# EAGLE design Murata D1U54P Power Supply Adapter rev2 (EAGLE 8.3.1)
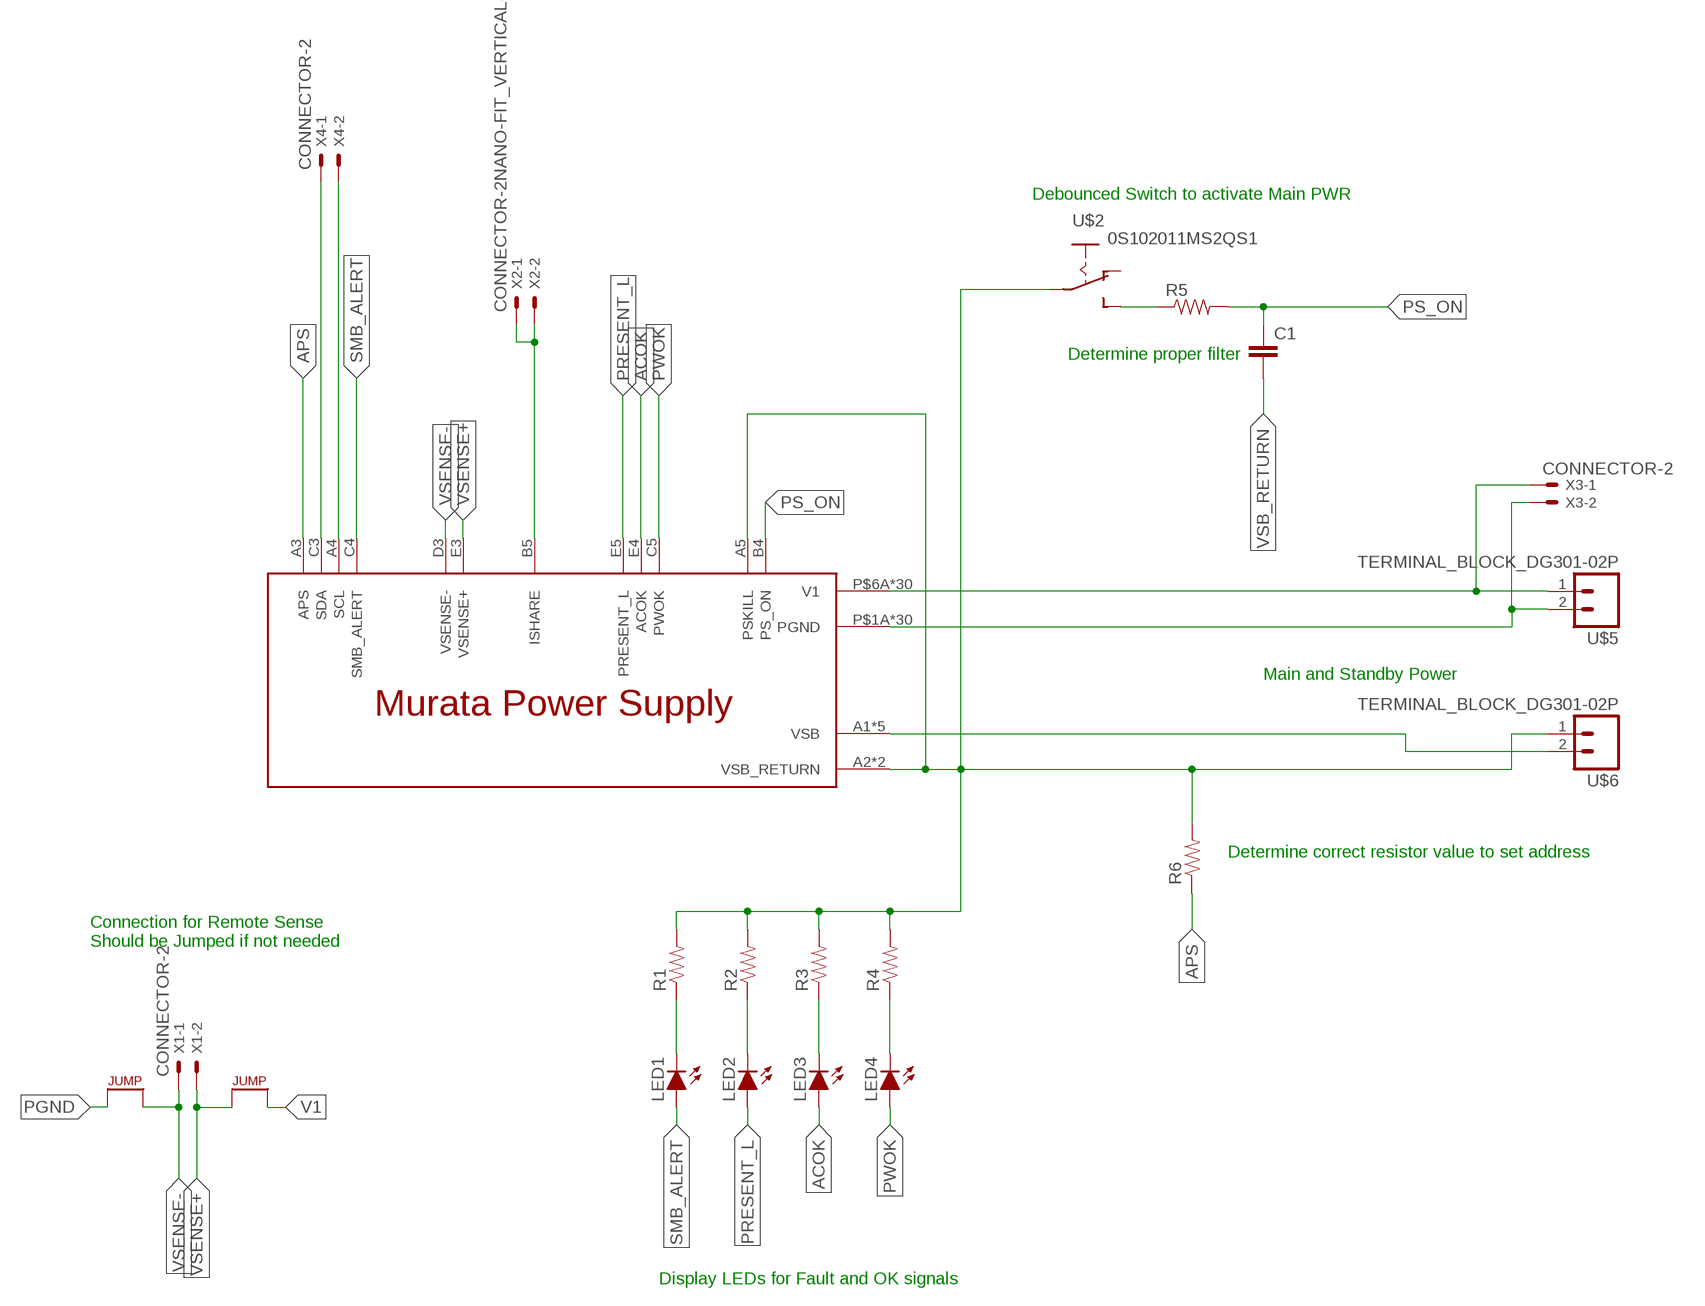
[diagram p0: schematic, sheet 1]

## Parts
C1  CAP0805  [0805]
LED1  LED-0805  [LED-805]
LED2  LED-0805  [LED-805]
LED3  LED-0805  [LED-805]
LED4  LED-0805  [LED-805]
R1  RESISTOR0805-RES  [0805]
R2  RESISTOR0805-RES  [0805]
R3  RESISTOR0805-RES  [0805]
R4  RESISTOR0805-RES  [0805]
R5  RESISTOR0805-RES  [0805]
R6  RESISTOR0805-RES  [0805]
U$1  MURATA_POWER_SUPPLY  [MURATA_POWER_SUPPLY_CONNECTOR]
U$2  0S102011MS2QS1  [0S102011MS2QS1]
U$3  JUMPER.1  [1X02]
U$4  JUMPER.1  [1X02]
U$5  TERMINAL_BLOCK_DG301-02P  [DG301-02P]
U$6  TERMINAL_BLOCK_DG301-02P  [DG301-02P]
X1  CONNECTOR-2  [MINIFIT_5566-2]
X2  CONNECTOR-2NANO-FIT_VERTICAL-2  [NANO-FIT_VERTICAL-2]
X3  CONNECTOR-2  [MINIFIT_5566-2]
X4  CONNECTOR-2  [MINIFIT_5566-2]

## Nets
ACOK: LED3.A U$1.E4(ACOK)
APS: R6.1 U$1.A3(APS)
N$1: LED4.C R4.1
N$2: LED3.C R3.1
N$3: LED2.C R2.1
N$4: LED1.C R1.1
N$5: U$1.B5(ISHARE) X2.P$1 X2.P$2
N$6: R5.1 U$2.P$3(S)
N$7: U$1.A1(VSB) U$1.B1(VSB) U$1.C1(VSB) U$1.D1(VSB) U$1.E1(VSB) U$6.2
PGND: U$1.P$1A(PGND) U$1.P$1B(PGND) U$1.P$1C(PGND) U$1.P$1D(PGND) U$1.P$1E(PGND) U$1.P$1F(PGND) U$1.P$2A(PGND) U$1.P$2B(PGND) U$1.P$2C(PGND) U$1.P$2D(PGND) U$1.P$2E(PGND) U$1.P$2F(PGND) U$1.P$3A(PGND) U$1.P$3B(PGND) U$1.P$3C(PGND) U$1.P$3D(PGND) U$1.P$3E(PGND) U$1.P$3F(PGND) U$1.P$4A(PGND) U$1.P$4B(PGND) U$1.P$4C(PGND) U$1.P$4D(PGND) U$1.P$4E(PGND) U$1.P$4F(PGND) U$1.P$5A(PGND) U$1.P$5B(PGND) U$1.P$5C(PGND) U$1.P$5D(PGND) U$1.P$5E(PGND) U$1.P$5F(PGND) U$4.1 U$5.2 X3.2
PRESENT_L: LED2.A U$1.E5(PRESENT_L)
PS_ON: C1.1 R5.2 U$1.B4(PS_ON)
PWOK: LED4.A U$1.C5(PWOK)
SCL: U$1.A4(SCL) X4.2
SDA: U$1.C3(SDA) X4.1
SMB_ALERT: LED1.A U$1.C4(SMB_ALERT)
V1: U$1.P$6A(V1) U$1.P$6B(V1) U$1.P$6C(V1) U$1.P$6D(V1) U$1.P$6E(V1) U$1.P$6F(V1) U$1.P$7A(V1) U$1.P$7B(V1) U$1.P$7C(V1) U$1.P$7D(V1) U$1.P$7E(V1) U$1.P$7F(V1) U$1.P$8A(V1) U$1.P$8B(V1) U$1.P$8C(V1) U$1.P$8D(V1) U$1.P$8E(V1) U$1.P$8F(V1) U$1.P$9A(V1) U$1.P$9B(V1) U$1.P$9C(V1) U$1.P$9D(V1) U$1.P$9E(V1) U$1.P$9F(V1) U$1.P$10A(V1) U$1.P$10B(V1) U$1.P$10C(V1) U$1.P$10D(V1) U$1.P$10E(V1) U$1.P$10F(V1) U$3.2 U$5.1 X3.1
VSB_RETURN: C1.2 R1.2 R2.2 R3.2 R4.2 R6.2 U$1.A2(VSB_RETURN) U$1.A5(PSKILL) U$1.B2(VSB_RETURN) U$2.P$2(P) U$6.1
VSENSE+: U$1.E3(VSENSE+) U$3.1 X1.2
VSENSE-: U$1.D3(VSENSE-) U$4.2 X1.1
Unconnected: U$2.P$1(O)

## Notes on the sheet
- Debounced Switch to activate Main PWR
- Determine proper filter
- Main and Standby Power
- Determine correct resistor value to set address
- Connection for Remote Sense
  Should be Jumped if not needed
- Display LEDs for Fault and OK signals

## Library data of the parts
C1 = HyTechDevices:CAP: Capacitor Standard 0603 ceramic capacitor, and 0.1" leaded capacitor.
LED1-LED4 = HyTechDevices:LED: Light Emitting Diode (LED) Source: Dangerous Prototypes Eagle Library <https://github.com/DangerousPrototypes/Eagle_Part_Library>
R1-R6 = HyTechDevices:RESISTOR: Resistor Basic schematic elements and footprints for 0603, 1206, and PTH resistors.
U$1 = HyTechDevices:MURATA_POWER_SUPPLY
U$2 = HyTechDevices:0S102011MS2QS1: Slide Switch 0S102011MS2QS1
U$3 U$4 = HyTechDevices:JUMPER: Jumper for changing operation of a device
U$5 U$6 = HyTechDevices:TERMINAL_BLOCK_DG301-02P: DG301-02P Terminal block Tayda Electronics Store <http://www.taydaelectronics.com/connectors-sockets/terminal-blocks/dg301-screw-terminal-block-2-positions-5mm.html> Datasheet <http://www.tme.eu/en/Document/72ad9f371bb0c16572574ac47903b3a1/DG301-5.0.pdf> Specs: Positions: 2 Pitch: 5.00mm Wire: 12-24 AWG Max Current: 15A Max Voltage: 300V
X1 X3 X4 = HyTechDevices:CONNECTOR-2: Mini-Fit Junior connector 2 pole Source: http://www.molex.com; OC_FARNELL: 1822072; OC_NEWARK: unknown
X2 = HyTechDevices:CONNECTOR-2: Mini-Fit Junior connector 2 pole Source: http://www.molex.com

## Board
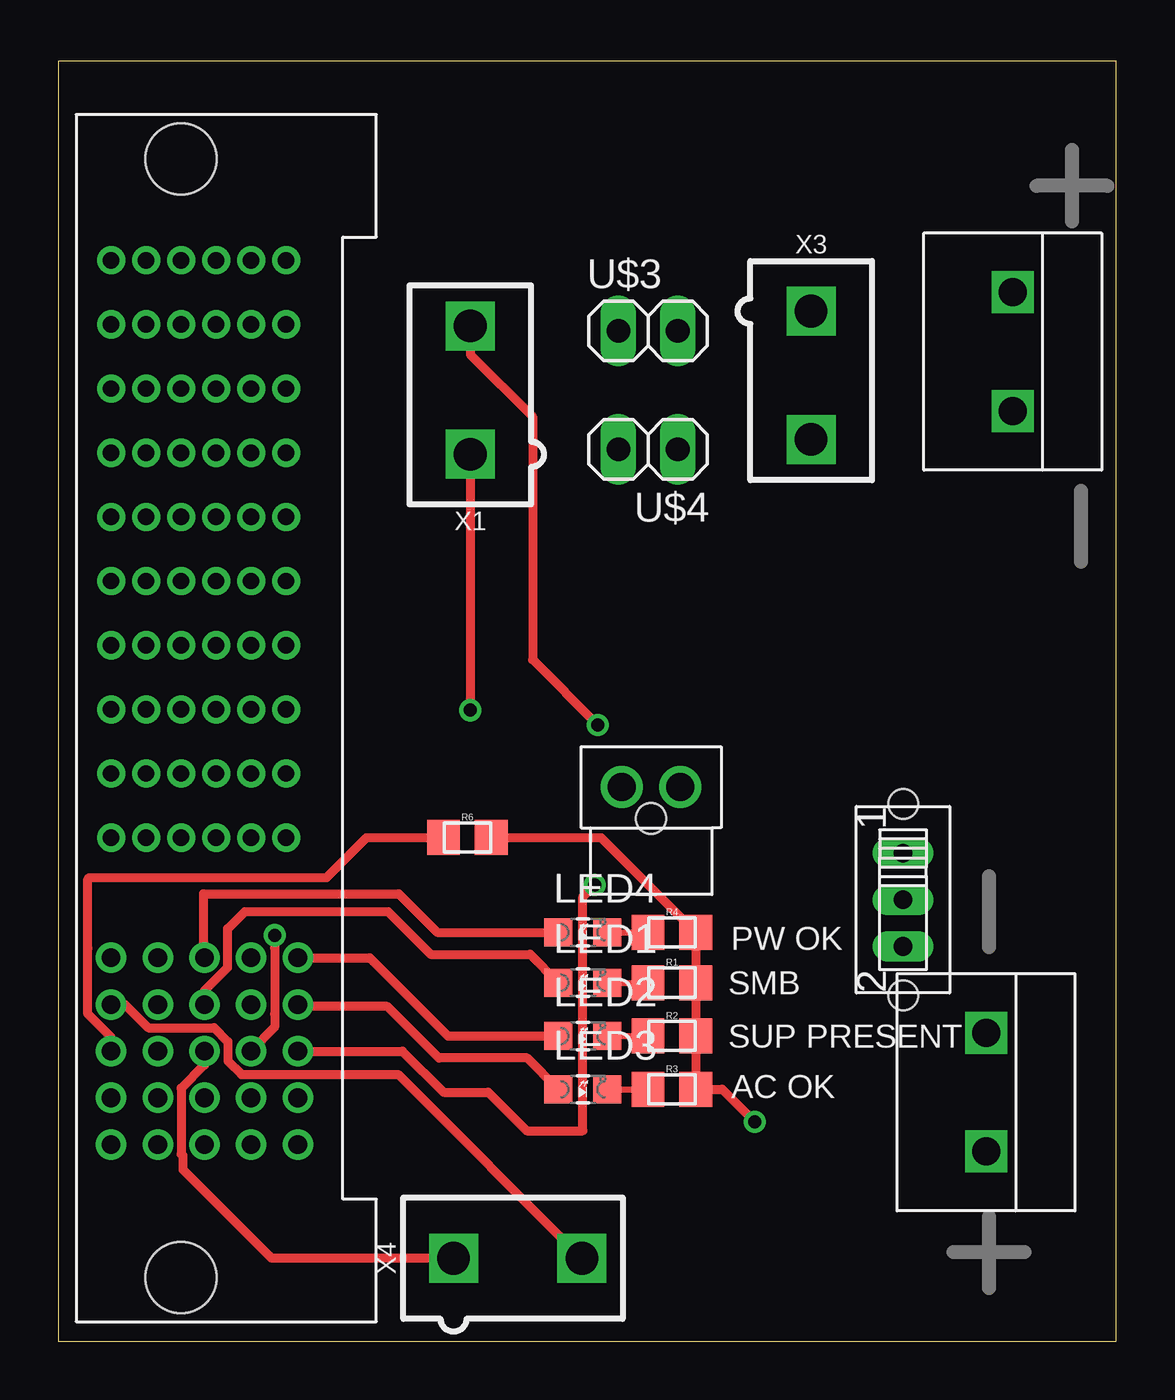
[diagram p1: board, top side]
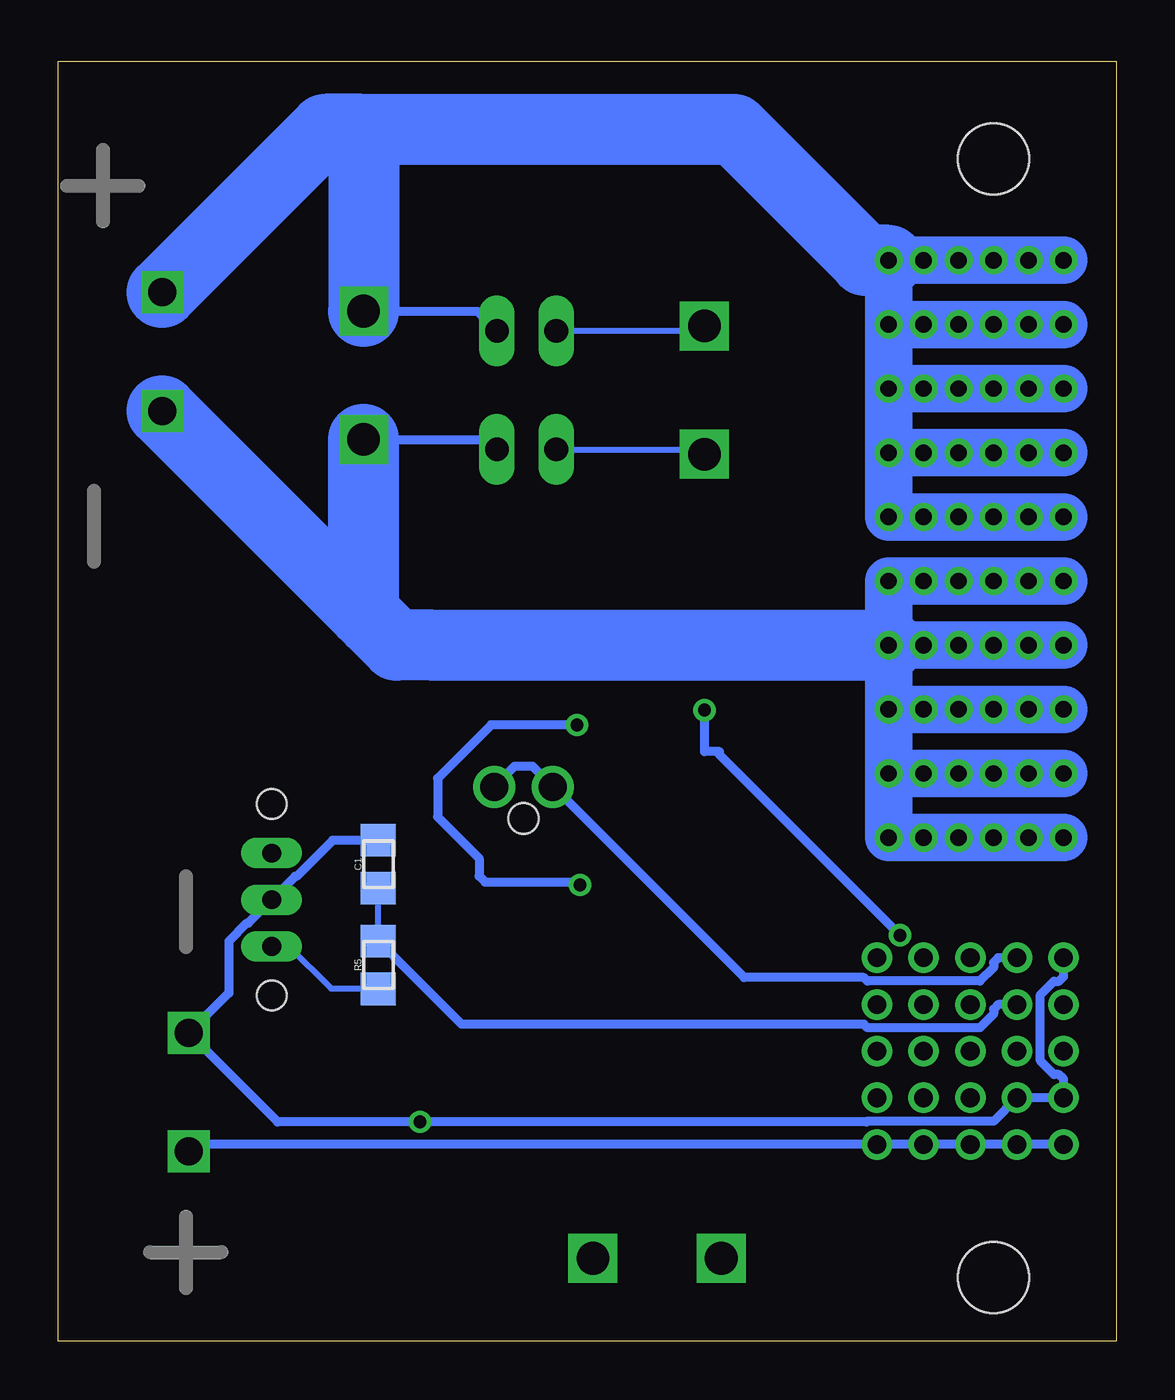
[diagram p2: board, bottom side, seen from below]

Size 45.34 x 54.86 mm. Coordinates in mm from the lower left corner, seen from the top.
Outline: 0,0 45.34,0 45.34,54.86 0,54.86 0,0
Copper layers (1*16): Top 0.035mm / dielectric 1.5mm / Bottom 0.035mm
Design rules "DRC Advanced Circuits": minimum track width 6mil, minimum drill 15mil, track to track 6mil, track to pad 6mil, pad to pad 6mil, via to via 6mil, smd to smd 6mil, copper to edge 40mil, drill to drill 6mil, minimum pad ring 10mil, minimum via ring 8mil, stop-mask expansion 4mil, vias tented up to drill 0mil, thermal gap 10mil

### Footprints (pad centres in the part's own frame; a part is rotated, then mirrored left to right if it is on the bottom)
0805 = smd 1.4 x 1.5: 1 -1.025,0; 2 1.025,0
LED-805 = smd 1.2 x 1.2: A 0,-1.05; C 0,1.05
MURATA_POWER_SUPPLY_CONNECTOR = drill 0.8: A1 44.145,1.5; A2 42.145,1.5; A3 40.145,1.5; A4 38.145,1.5; A5 36.145,1.5; B1 44.145,3.5; B2 42.145,3.5; B3 40.145,3.5; B4 38.145,3.5; B5 36.145,3.5; C1 44.145,5.5; C2 42.145,5.5; C3 40.145,5.5; C4 38.145,5.5; C5 36.145,5.5; D1 44.145,7.5; D2 42.145,7.5; D3 40.145,7.5; D4 38.145,7.5; D5 36.145,7.5; E1 44.145,9.5; E2 42.145,9.5; E3 40.145,9.5; E4 38.145,9.5; E5 36.145,9.5 | drill 0.7: P$1A 30.995,9; P$1B 30.995,7.5; P$1C 30.995,6; P$1D 30.995,4.5; P$1E 30.995,3; P$1F 30.995,1.5; P$2A 28.245,9; P$2B 28.245,7.5; P$2C 28.245,6; P$2D 28.245,4.5; P$2E 28.245,3; P$2F 28.245,1.5; P$3A 25.495,9; P$3B 25.495,7.5; P$3C 25.495,6; P$3D 25.495,4.5; P$3E 25.495,3; P$3F 25.495,1.5; P$4A 22.745,9; P$4B 22.745,7.5; P$4C 22.745,6; P$4D 22.745,4.5; P$4E 22.745,3; P$4F 22.745,1.5; P$5A 19.995,9; P$5B 19.995,7.5; P$5C 19.995,6; P$5D 19.995,4.5; P$5E 19.995,3; P$5F 19.995,1.5; P$6A 17.245,9; P$6B 17.245,7.5; P$6C 17.245,6; P$6D 17.245,4.5; P$6E 17.245,3; P$6F 17.245,1.5; P$7A 14.495,9; P$7B 14.495,7.5; P$7C 14.495,6; P$7D 14.495,4.5; P$7E 14.495,3; P$7F 14.495,1.5; P$8A 11.745,9; P$8B 11.745,7.5; P$8C 11.745,6; P$8D 11.745,4.5; P$8E 11.745,3; P$8F 11.745,1.5; P$9A 8.995,9; P$9B 8.995,7.5; P$9C 8.995,6; P$9D 8.995,4.5; P$9E 8.995,3; P$9F 8.995,1.5; P$10A 6.245,9; P$10B 6.245,7.5; P$10C 6.245,6; P$10D 6.245,4.5; P$10E 6.245,3; P$10F 6.245,1.5 | hole 3.05: 1.9,4.5; 49.84,4.5
0S102011MS2QS1 = drill 0.8 long: P$1 -2,0; P$2 0,0; P$3 2,0 | hole 1.27: 4.102,0; -4.102,0
1X02 = drill 1.016 long: 1 -1.27,0; 2 1.27,0
DG301-02P = drill 1.2 square: 1 2.54,3.81; 2 7.62,3.81
MINIFIT_5566-2 = drill 1.4 square: 1 0,-2.75; 2 0,2.75
NANO-FIT_VERTICAL-2 = drill 1.2: P$1 -1.25,0; P$2 1.25,0 | hole 1.3: 0,-1.34

### Placement (x,y rotation side)
C1  31.62,20.45 90 bottom
LED1  22.48,15.37 270 top
LED2  22.48,13.08 270 top
LED3  22.48,10.79 270 top
LED4  22.48,17.53 270 top
R1  26.29,15.37 0 top
R2  26.29,13.08 0 top
R3  26.29,10.79 0 top
R4  26.29,17.53 0 top
R5  31.62,16.13 90 bottom
R6  17.53,21.59 0 top
U$1  0.76,52.58 270 top
U$2  36.2,18.92 270 top
U$3  25.27,43.31 0 top
U$4  25.27,38.23 180 top
U$5  37.08,47.5 270 top
U$6  35.94,15.75 270 top
X1  17.65,40.77 0 top
X2  25.4,23.75 0 top
X3  32.26,41.4 180 top
X4  19.68,3.56 270 top

### Tracks (layer width: path | path; a pad name or v marks a point on that pad's centre or on a via)
ACOK
  Top 0.381: LED3.A 20.09,12.14 16.31,12.14 14.1,14.35 10.34,14.35 U$1.E4
APS
  Top 0.381: R6.1 13.21,21.59 11.49,19.88 1.33,19.88 1.27,19.81 1.27,16.85 1.27,14.02 2.26,13.02 U$1.A3
N$1
  Top 0.254: LED4.C R4.1
N$2
  Top 0.254: LED3.C R3.1
N$3
  Top 0.254: LED2.C R2.1
N$4
  Top 0.254: LED1.C R1.1
N$5
  Bottom 0.381: U$1.B5 5.06,16.43 5.27,16.23 5.27,16.02 5.85,15.44 10.68,15.44 10.83,15.59 15.95,15.59 24.12,23.75 X2.P$1 24.15,23.77 25.02,24.64 25.8,24.64 26.67,23.77 X2.P$2
N$6
  Bottom 0.152: 31.63,15.11 R5.1
  Bottom 0.254: U$2.P$3 35.46,16.92 33.65,15.11 31.63,15.11
N$7
  Bottom 0.381: U$1.A1 U$1.B1 U$1.C1 U$1.D1 U$1.E1 39.45,8.43 U$6.2
PGND
  Bottom 0.305: 29.34,29.89 29.28,29.83
  Bottom 0.381: X3.2 26.97,38.65 U$4.1
  Bottom 2.032: U$1.P$4A U$1.P$4B U$1.P$4C U$1.P$4D U$1.P$4E U$1.P$4F | U$1.P$3A U$1.P$3B U$1.P$3C U$1.P$3D U$1.P$3E U$1.P$3F | U$1.P$2A U$1.P$2B U$1.P$2C U$1.P$2D U$1.P$2E U$1.P$2F | U$1.P$1F U$1.P$1E U$1.P$1D U$1.P$1C U$1.P$1B U$1.P$1A U$1.P$2A | U$1.P$5F U$1.P$5E U$1.P$5D U$1.P$5C U$1.P$5B U$1.P$5A U$1.P$4A | U$1.P$4A U$1.P$3A | U$1.P$3A U$1.P$2A
  Bottom 3.048: U$1.P$4A 29.28,29.83 30.85,29.83 31.89,30.88 | 31.89,30.88 U$5.2 | X3.2 32.26,31.24 31.89,30.88
PRESENT_L
  Top 0.381: LED2.A 16.69,13.08 13.34,16.43 U$1.E5
PS_ON
  Bottom 0.254: R5.2 C1.1
  Bottom 0.381: U$1.B4 5.06,14.43 5.27,14.23 5.27,14.02 5.85,13.44 10.68,13.44 10.83,13.59 28.05,13.59 R5.2
PWOK
  Top 0.381: LED4.A 16.24,17.53 14.59,19.18 6.22,19.18 6.22,16.47 U$1.C5
SCL
  Top 0.381: U$1.A4 2.85,14.43 3.85,13.43 6.68,13.43 7.27,12.84 7.27,12.02 7.85,11.44 8.5,11.44 8.51,11.43 14.56,11.43 X4.2
SDA
  Top 0.381: X4.1 9.14,3.56 5.33,7.37 5.33,7.95 5.27,8.02 5.27,10.85 6.26,11.84 U$1.C3
SMB_ALERT
  Top 0.152: LED1.A 21.25,15.19
  Top 0.381: LED1.A 20.21,16.58 15.95,16.58 14.12,18.41 8,18.41 7.26,17.67 7.26,16.02 6.26,15.02 U$1.C4
V1
  Bottom 0.305: 29.34,51.76 29.52,51.94
  Bottom 0.381: X3.1 27.39,44.15 U$3.2
  Bottom 2.032: U$1.P$9A U$1.P$9B U$1.P$9C U$1.P$9D U$1.P$9E U$1.P$9F | U$1.P$8A U$1.P$8B U$1.P$8C U$1.P$8D U$1.P$8E U$1.P$8F | U$1.P$7A U$1.P$7B U$1.P$7C U$1.P$7D U$1.P$7E U$1.P$7F | U$1.P$6F U$1.P$6E U$1.P$6D U$1.P$6C U$1.P$6B U$1.P$6A U$1.P$7A | U$1.P$10F U$1.P$10E U$1.P$10D U$1.P$10C U$1.P$10B U$1.P$10A U$1.P$9A | U$1.P$8A U$1.P$9A | U$1.P$7A U$1.P$8A
  Bottom 3.048: U$1.P$10A 10.77,46.33 16.38,51.94 29.52,51.94 32.35,51.94 | 32.35,51.94 33.91,51.94 U$5.1 | X3.1 32.26,51.85 32.35,51.94
VSB_RETURN  (via drill 0.55)
  Top 0.381: R6.2 23.25,21.59 R4.2 R1.2 R2.2 R3.2 28.45,10.79 v29.84,9.4
  Bottom 0.381: 4.68,10.43 U$1.B2 | U$1.A5 2.26,15.63 2.46,15.43 2.67,15.43 3.26,14.85 3.26,12.02 2.67,11.44 2.46,11.44 2.26,11.23 U$1.A2 U$1.B2 | C1.2 33.58,21.47 35.13,19.93 35.19,19.93 U$2.P$2 37.2,17.92 37.26,17.92 38.04,17.14 38.04,14.92 U$6.1 35.94,9.4 v29.84,9.4 10.71,9.4 10.68,9.43 5.27,9.43 U$1.B2
VSENSE+  (via drill 0.55)
  Top 0.381: X1.2 17.65,42.29 20.32,39.62 20.32,29.21 v23.11,26.42 | U$1.E3 14.75,12.43 16.51,10.67 18.41,10.67 20.07,9.02 22.48,9.02 22.48,19.05 v22.99,19.56
  Bottom 0.254: U$3.1 17.86,43.31 X1.2
  Bottom 0.381: v23.11,26.42 26.8,26.42 29.08,24.13 29.08,22.48 27.3,20.7 27.3,19.94 27.05,19.68 23.11,19.68 v22.99,19.56
VSENSE-  (via drill 0.55)
  Top 0.381: X1.1 v17.65,27.05 | v9.27,17.4 9.27,16.85 9.27,14.02 9.27,14.01 9.27,13.46 8.26,12.45 U$1.D3
  Bottom 0.254: U$4.2 17.86,38.23 X1.1
  Bottom 0.381: v17.65,27.05 17.65,25.27 17.02,25.27 17.02,25.15 v9.27,17.4

### Text on the board
tPlace: PW OK | SMB | SUP PRESENT | AC OK
tDocu: 2019 Murata D1U54P adapter rev2 | Parker Jones